# EasyEDA schematic schematic.json
TITLE: Christmas Tree LED Chaser; REV: 1.0; Date: 2024-10-16; Sheet: 1/1; Drawn By: Andrew; Company: Your Company
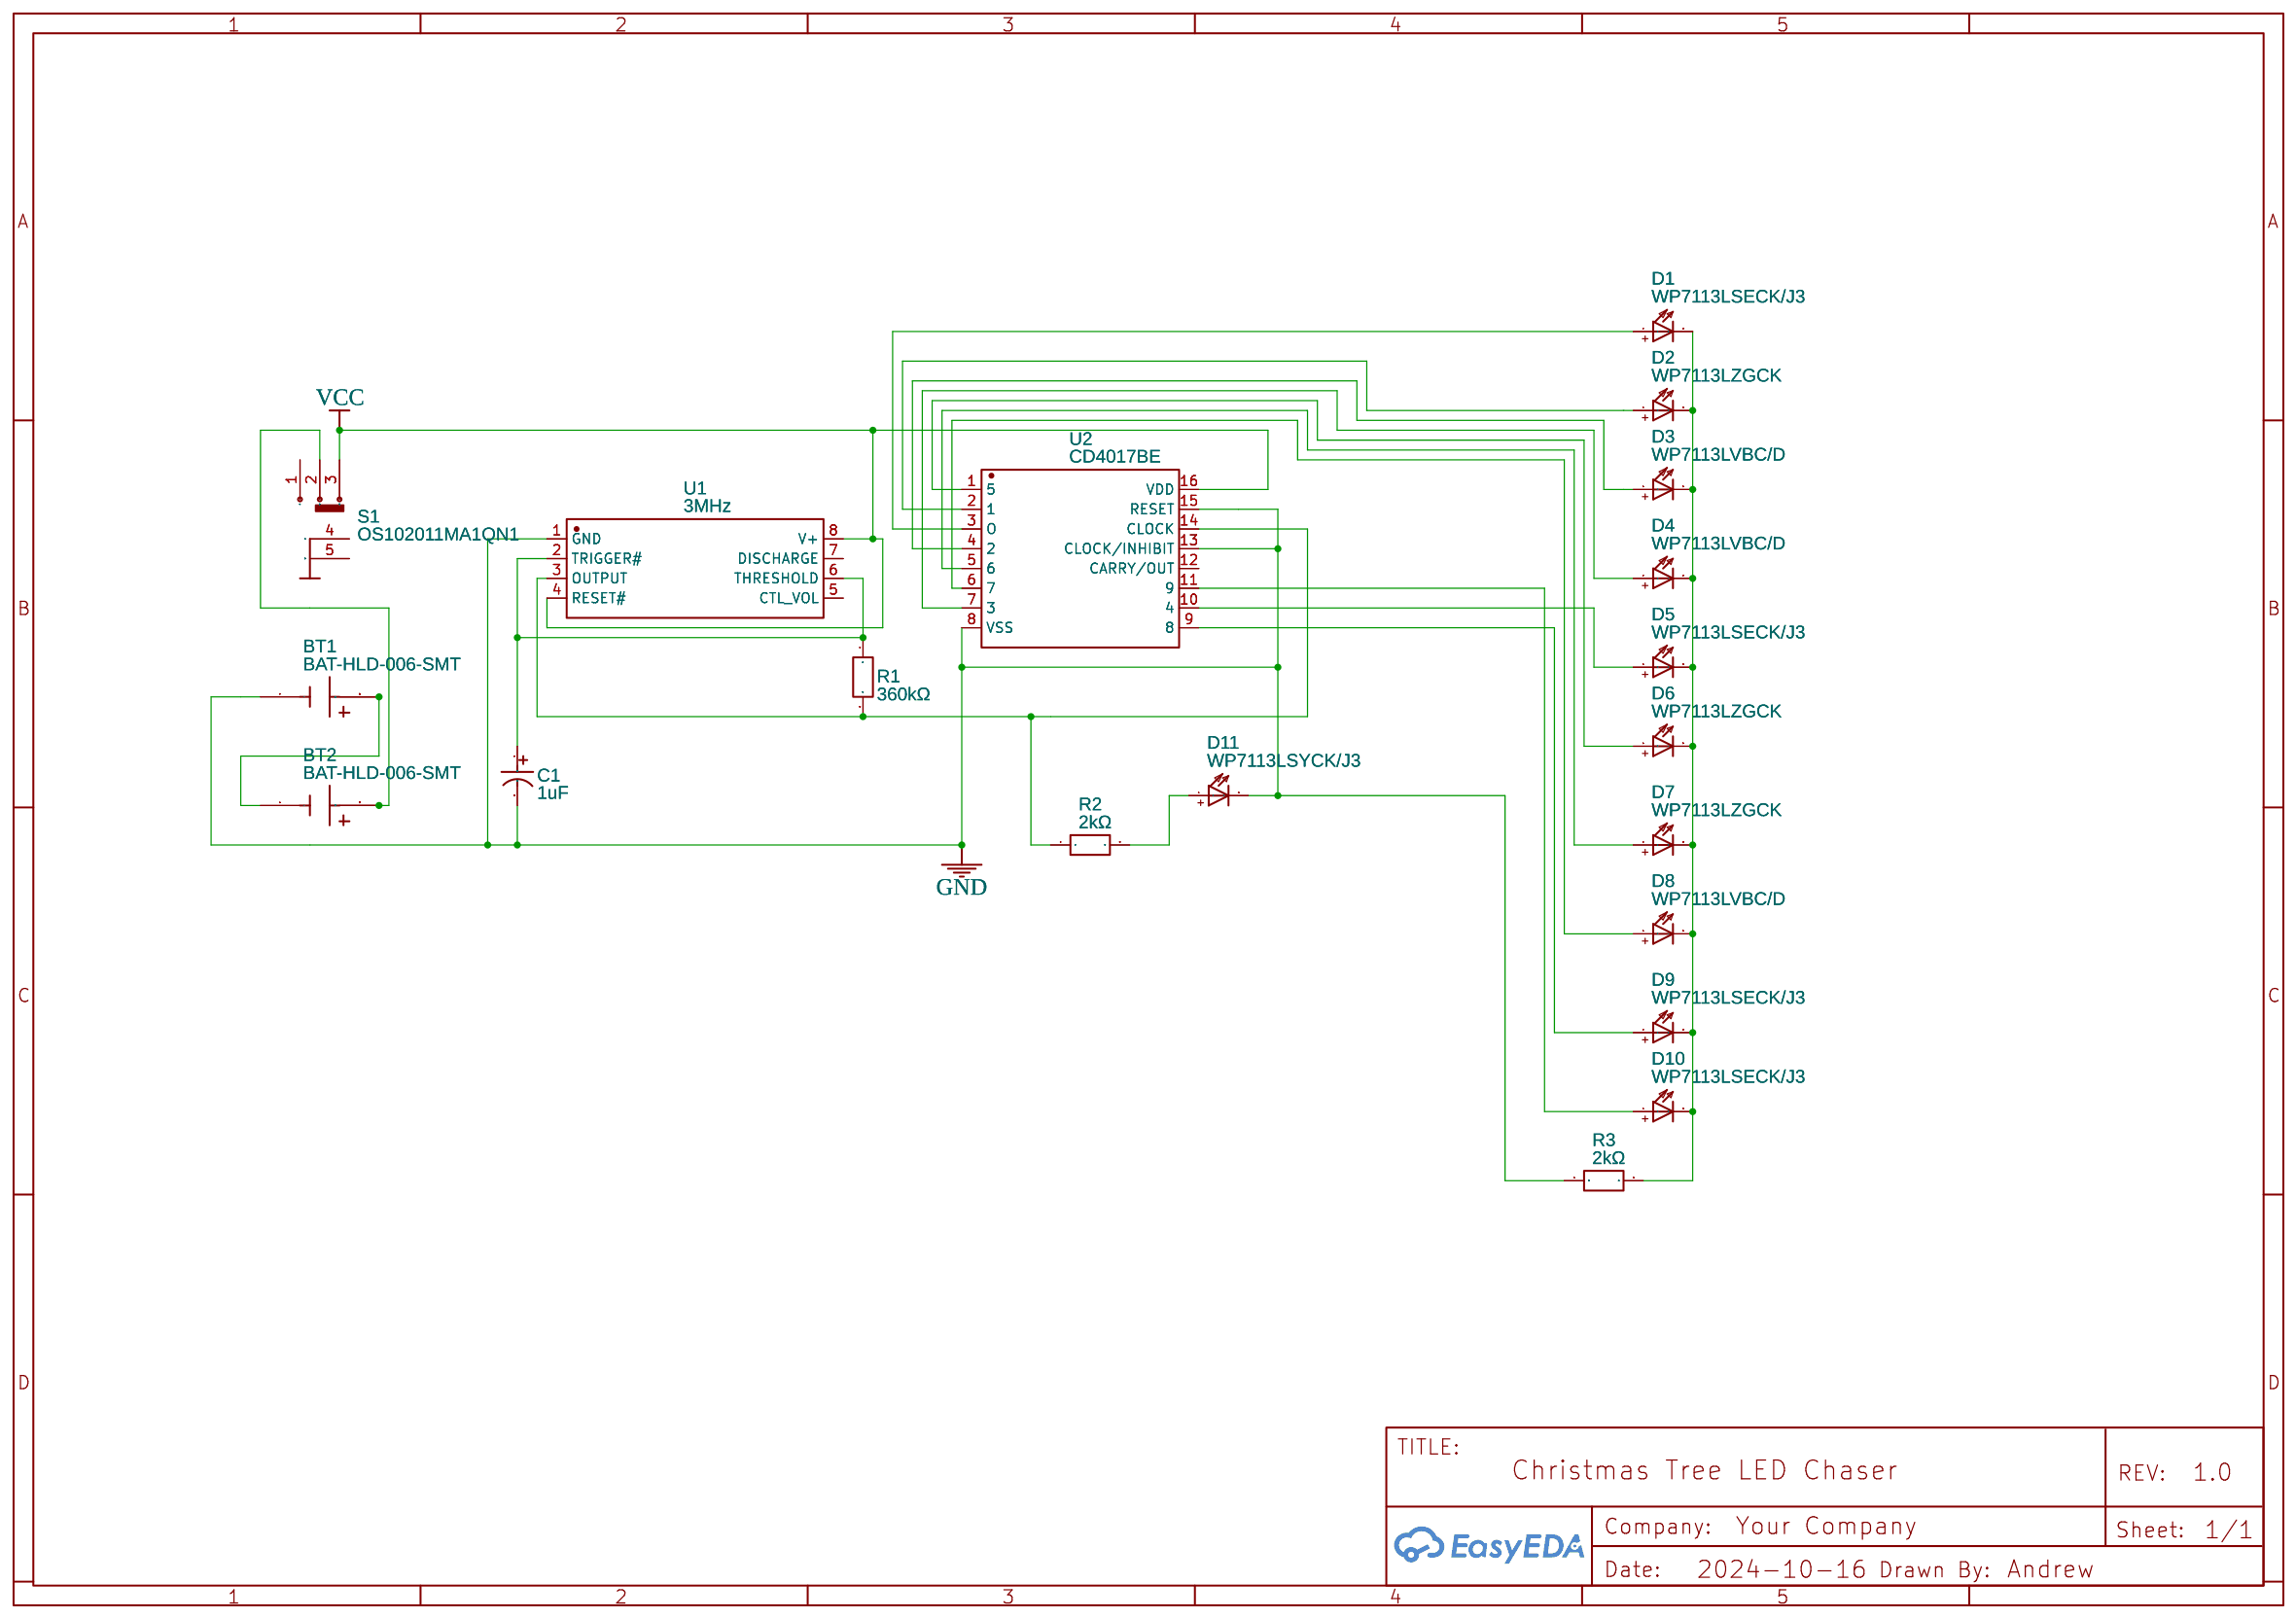
[diagram p0: schematic sheet]

## Parts
BT1  BAT-HLD-006-SMT  [BAT_BAT-HLD-006-SMT]
BT2  BAT-HLD-006-SMT  [BAT_BAT-HLD-006-SMT]
C1  1uF  [CAP-TH_BD5.0-P2.00-D0.8-FD]
D1  WP7113LSECK/J3  [MCL053MD LED, RED, THROUGH HOLE, T-1 3/4 (5MM), 20 MA, 2 V, 625 NM]
D2  WP7113LZGCK  [MCL053MD LED, RED, THROUGH HOLE, T-1 3/4 (5MM), 20 MA, 2 V, 625 NM]
D3  WP7113LVBC/D  [MCL053MD LED, RED, THROUGH HOLE, T-1 3/4 (5MM), 20 MA, 2 V, 625 NM]
D4  WP7113LVBC/D  [MCL053MD LED, RED, THROUGH HOLE, T-1 3/4 (5MM), 20 MA, 2 V, 625 NM]
D5  WP7113LSECK/J3  [MCL053MD LED, RED, THROUGH HOLE, T-1 3/4 (5MM), 20 MA, 2 V, 625 NM]
D6  WP7113LZGCK  [MCL053MD LED, RED, THROUGH HOLE, T-1 3/4 (5MM), 20 MA, 2 V, 625 NM]
D7  WP7113LZGCK  [MCL053MD LED, RED, THROUGH HOLE, T-1 3/4 (5MM), 20 MA, 2 V, 625 NM]
D8  WP7113LVBC/D  [MCL053MD LED, RED, THROUGH HOLE, T-1 3/4 (5MM), 20 MA, 2 V, 625 NM]
D9  WP7113LSECK/J3  [MCL053MD LED, RED, THROUGH HOLE, T-1 3/4 (5MM), 20 MA, 2 V, 625 NM]
D10  WP7113LSECK/J3  [MCL053MD LED, RED, THROUGH HOLE, T-1 3/4 (5MM), 20 MA, 2 V, 625 NM]
D11  WP7113LSYCK/J3  [MCL053MD LED, RED, THROUGH HOLE, T-1 3/4 (5MM), 20 MA, 2 V, 625 NM]
R1  360kΩ  [RES-TH_BD2.3-L6.0-P10.00-D0.6]
R2  2kΩ  [RES-TH_BD2.3-L6.0-P10.00-D0.4]
R3  2kΩ  [RES-TH_BD2.3-L6.0-P10.00-D0.4]
S1  OS102011MA1QN1  [SW-TH_OS102011MA1QN1]
U1  3MHz  [DIP-8_L9.6-W6.4-P2.54-LS7.9-BL]
U2  CD4017BE  [DIP-16_16P-L20.2-W6.6-P2.54-LS7.6-BL]

## Library data of the parts
BT1 BT2 = BAT-HLD-006-SMT: Contributor: brit.titus
C1 = 50YXJ1M5X11: Supplier: LCSC; Manufacturer: rubycon(红宝石); Supplier Part: C88782; JLCPCB Part Class: Extended Part
D1 D5 D9 D10 = WP7113LSECK/J3: Manufacturer: Kingbright; Supplier: Digi-Key; Supplier Part: 754-1916-ND; Contributor: radi8
D2 D6 D7 = WP7113LZGCK: Manufacturer: Kingbright; Supplier: Digi-Key; Supplier Part: 754-1920-ND; Contributor: radi8
D3 D4 D8 = WP7113LVBC/D: Manufacturer: Kingbright; Supplier: Digi-Key; Supplier Part: 754-1919-ND; Contributor: radi8
D11 = WP7113LSYCK/J3: Manufacturer: Kingbright; Supplier: Digi-Key; Supplier Part: 754-1918-ND; Contributor: radi8
R1 = CF14JT360K: Contributor: lcsc; Supplier: LCSC; Supplier Part: C2585255; Manufacturer: SEI(Stackpole Electronics Inc.)
R2 R3 = CF14JT2K00: Supplier: LCSC; Supplier Part: C6533273; Manufacturer: SEI(Stackpole Electronics Inc.); JLCPCB Part Class: Extended Part; Contributor: lcsc
S1 = OS102011MA1QN1: Contributor: LCSC; Supplier: LCSC; Supplier Part: C226259; Manufacturer: C&K; JLCPCB Part Class: Extended Part
U1 = LMC555CN/NOPB: Contributor: lcsc; Supplier: LCSC; Supplier Part: C1520185; Manufacturer: TI(德州仪器); JLCPCB Part Class: Extended Part
U2 = CD4017BE: Contributor: LCSC; Supplier: LCSC; Manufacturer: TI(德州仪器); Supplier Part: C34519; JLCPCB Part Class: Extended Part

## Nets
GND: BT1.N(-) C1.2 D11.2(-) R3.1 U1.1(GND) U2.8(VSS) U2.13(CLOCK/INHIBIT) U2.15(RESET)
VCC: S1.3 U1.4(RESET#) U1.8(V+) U2.16(VDD)
Net-(BT1-P1): BT1.P1(+) BT1.P2(+) BT2.N(-)
Net-(BT2-P1): BT2.P1(+) BT2.P2(+) S1.2
Net-(C1-1): C1.1 R1.1 U1.2(TRIGGER#) U1.6(THRESHOLD)
Net-(D1-1): D1.1(+) U2.3(O)
Net-(D1-2): D1.2(-) D2.2(-) D3.2(-) D4.2(-) D5.2(-) D6.2(-) D7.2(-) D8.2(-) D9.2(-) D10.2(-) R3.2
Net-(D2-1): D2.1(+) U2.2(1)
Net-(D3-1): D3.1(+) U2.4(2)
Net-(D4-1): D4.1(+) U2.7(3)
Net-(D5-1): D5.1(+) U2.10(4)
Net-(D6-1): D6.1(+) U2.1(5)
Net-(D7-1): D7.1(+) U2.5(6)
Net-(D8-1): D8.1(+) U2.6(7)
Net-(D9-1): D9.1(+) U2.9(8)
Net-(D10-1): D10.1(+) U2.11(9)
Net-(D11-1): D11.1(+) R2.2
Net-(R1-2): R1.2 R2.1 U1.3(OUTPUT) U2.14(CLOCK)

Not connected (* = marked no-connect by the designer): S1 1 4 5; U1 5(CTL_VOL) 7(DISCHARGE); U2 12(CARRY/OUT)
